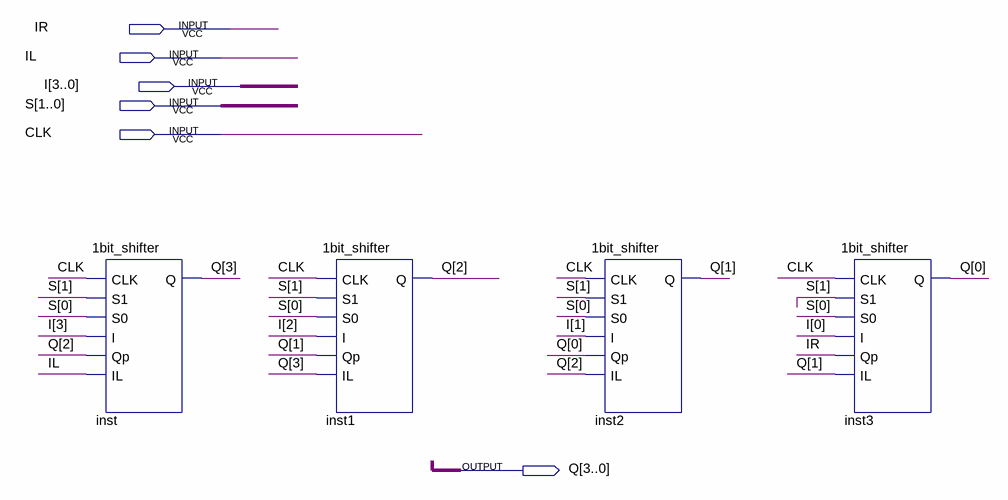
[diagram p0: schematic sheet]
// Quartus schematic 4BIT_SHIFT.bdf as structural Verilog: 4 symbols, 6 pins
module \4BIT_SHIFT  (
  input  IR,
  input  IL,
  input  [3:0] I,
  input  [1:0] S,
  input  CLK,
  output [3:0] Q
);

  \1bit_shifter  inst (.CLK(CLK), .S1(S[1]), .S0(S[0]), .I(I[3]), .Qp(Q[2]), .IL(IL), .Q(Q[3]));
  \1bit_shifter  inst1 (.CLK(CLK), .S1(S[1]), .S0(S[0]), .I(I[2]), .Qp(Q[1]), .IL(Q[3]), .Q(Q[2]));
  \1bit_shifter  inst2 (.CLK(CLK), .S1(S[1]), .S0(S[0]), .I(I[1]), .Qp(Q[0]), .IL(Q[2]), .Q(Q[1]));
  \1bit_shifter  inst3 (.CLK(CLK), .S1(S[1]), .S0(S[0]), .I(I[0]), .Qp(IR), .IL(Q[1]), .Q(Q[0]));
endmodule
